# EAGLE schematic untitled (EAGLE 9.0.0)
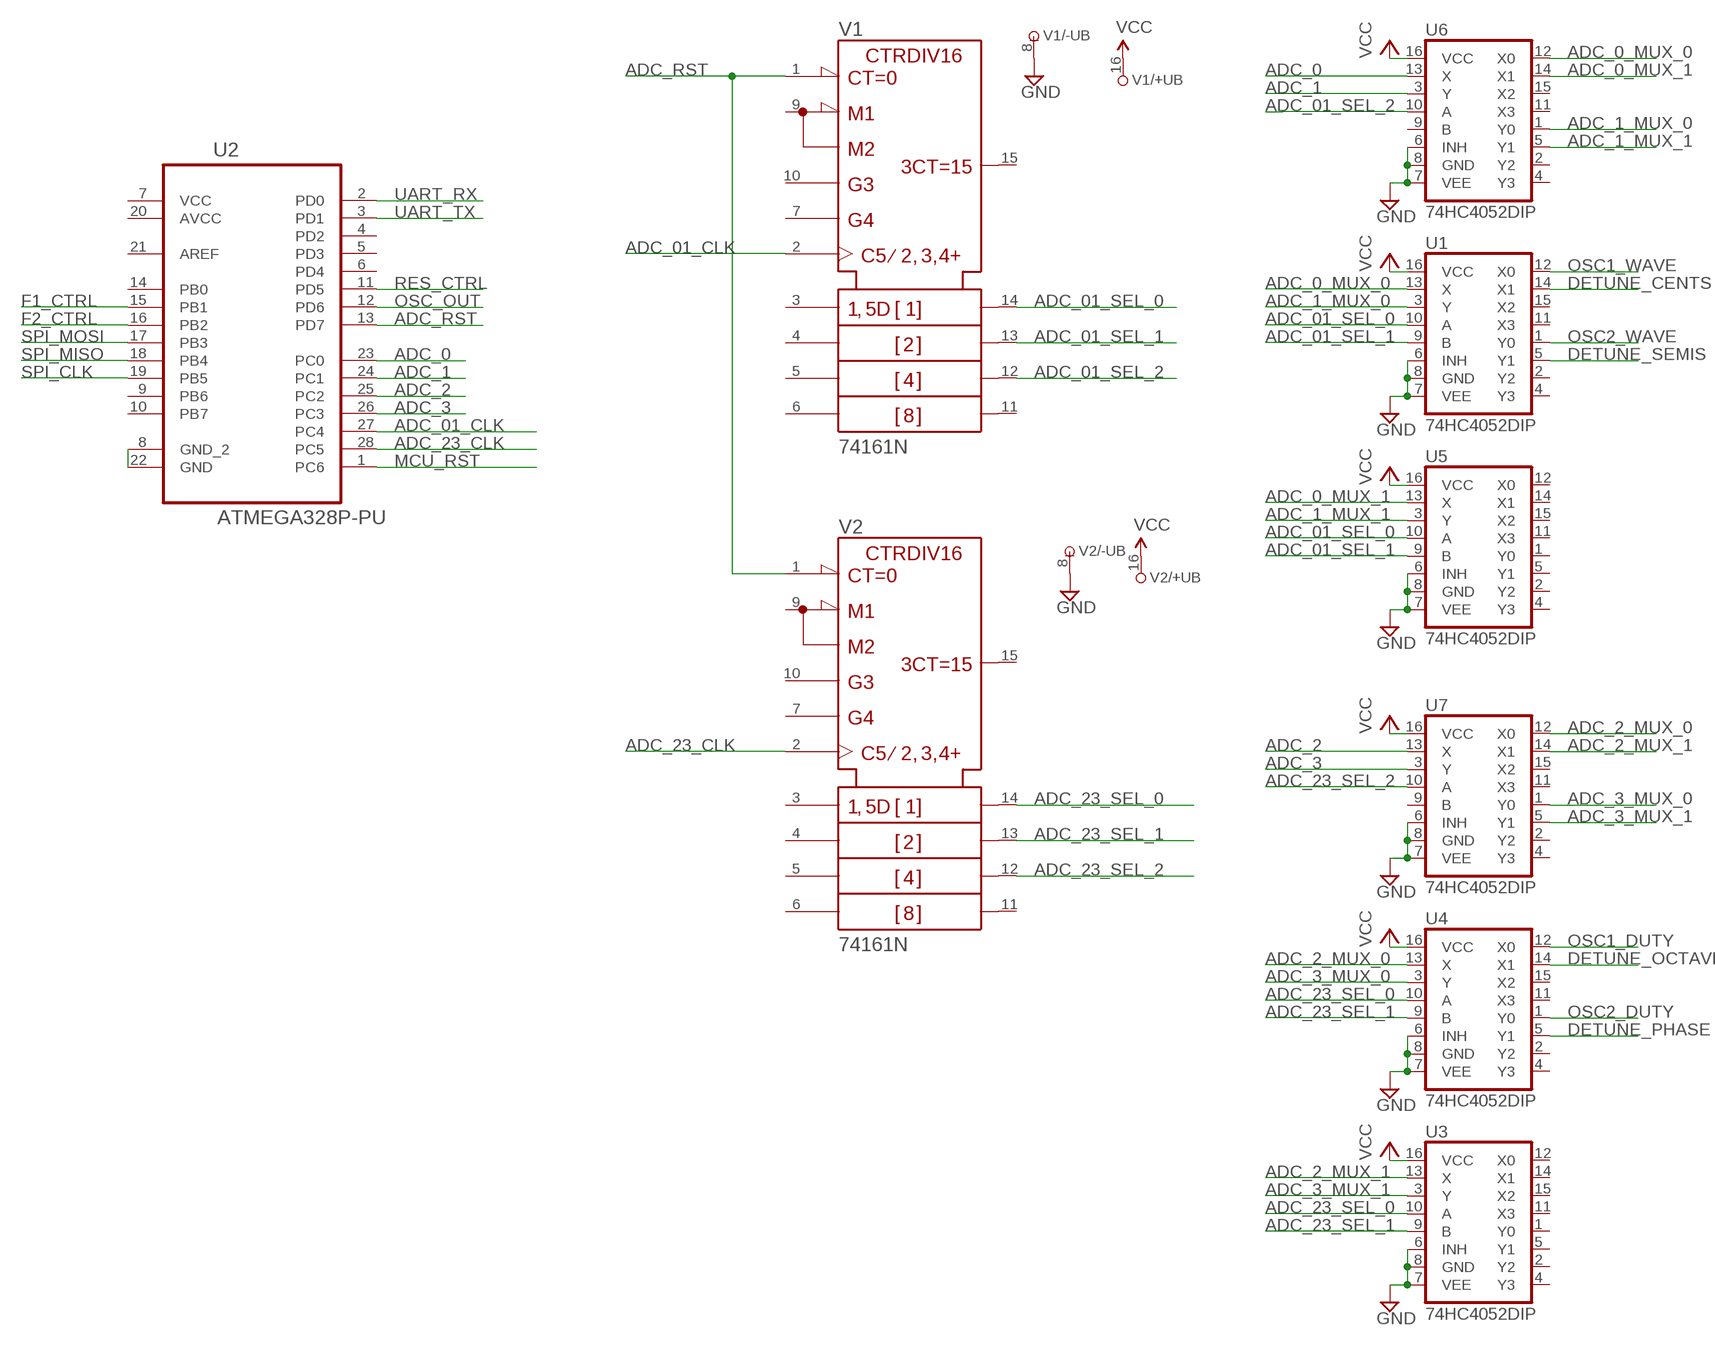
[diagram p0: schematic, sheet 1]

## Parts
U1  74HC4052DIP  [DIL16]
U2  ATMEGA328P-PU  [DIP254P762X457-28]
U3  74HC4052DIP  [DIL16]
U4  74HC4052DIP  [DIL16]
U5  74HC4052DIP  [DIL16]
U6  74HC4052DIP  [DIL16]
U7  74HC4052DIP  [DIL16]
V1  74161N  [DIL16]
V2  74161N  [DIL16]

## Nets
ADC_0: U2.23(PC0) U6.13(X)
ADC_0_MUX_0: U1.13(X) U6.12(X0)
ADC_0_MUX_1: U5.13(X) U6.14(X1)
ADC_1: U2.24(PC1) U6.3(Y)
ADC_01_CLK: U2.27(PC4) V1.2(CLK)
ADC_1_MUX_0: U1.3(Y) U6.1(Y0)
ADC_1_MUX_1: U5.3(Y) U6.5(Y1)
ADC_01_SEL_0: U1.10(A) U5.10(A) V1.14(QA)
ADC_01_SEL_1: U1.9(B) U5.9(B) V1.13(QB)
ADC_01_SEL_2: U6.10(A) V1.12(QC)
ADC_2: U2.25(PC2) U7.13(X)
ADC_2_MUX_0: U4.13(X) U7.12(X0)
ADC_2_MUX_1: U3.13(X) U7.14(X1)
ADC_3: U2.26(PC3) U7.3(Y)
ADC_3_MUX_0: U4.3(Y) U7.1(Y0)
ADC_3_MUX_1: U3.3(Y) U7.5(Y1)
ADC_23_CLK: U2.28(PC5) V2.2(CLK)
ADC_23_SEL_0: U3.10(A) U4.10(A) V2.14(QA)
ADC_23_SEL_1: U3.9(B) U4.9(B) V2.13(QB)
ADC_23_SEL_2: U7.10(A) V2.12(QC)
ADC_RST: U2.13(PD7) V1.1(!CLR) V2.1(!CLR)
DETUNE_CENTS: U1.14(X1)
DETUNE_OCTAVE: U4.14(X1)
DETUNE_PHASE: U4.5(Y1)
DETUNE_SEMIS: U1.5(Y1)
F1_CTRL: U2.15(PB1)
F2_CTRL: U2.16(PB2)
GND: U1.6(INH) U1.7(VEE) U1.8(GND) U3.6(INH) U3.7(VEE) U3.8(GND) U4.6(INH) U4.7(VEE) U4.8(GND) U5.6(INH) U5.7(VEE) U5.8(GND) U6.6(INH) U6.7(VEE) U6.8(GND) U7.6(INH) U7.7(VEE) U7.8(GND) V1.8(-UB) V2.8(-UB)
MCU_RST: U2.1(PC6)
N$2: U2.8(GND_2) U2.22(GND)
OSC1_DUTY: U4.12(X0)
OSC1_WAVE: U1.12(X0)
OSC2_DUTY: U4.1(Y0)
OSC2_WAVE: U1.1(Y0)
OSC_OUT: U2.12(PD6)
RES_CTRL: U2.11(PD5)
SPI_CLK: U2.19(PB5)
SPI_MISO: U2.18(PB4)
SPI_MOSI: U2.17(PB3)
UART_RX: U2.2(PD0)
UART_TX: U2.3(PD1)
VCC: U1.16(VCC) U3.16(VCC) U4.16(VCC) U5.16(VCC) U6.16(VCC) U7.16(VCC) V1.16(+UB) V2.16(+UB)
Unconnected: U1.2(Y2) U1.4(Y3) U1.11(X3) U1.15(X2) U2.4(PD2) U2.5(PD3) U2.6(PD4) U2.9(PB6) U2.10(PB7) U2.14(PB0) U2.21(AREF) U3.1(Y0) U3.2(Y2) U3.4(Y3) U3.5(Y1) U3.11(X3) U3.12(X0) U3.14(X1) U3.15(X2) U4.2(Y2) U4.4(Y3) U4.11(X3) U4.15(X2) U5.1(Y0) U5.2(Y2) U5.4(Y3) U5.5(Y1) U5.11(X3) U5.12(X0) U5.14(X1) U5.15(X2) U6.2(Y2) U6.4(Y3) U6.9(B) U6.11(X3) U6.15(X2) U7.2(Y2) U7.4(Y3) U7.9(B) U7.11(X3) U7.15(X2) V1.3(A) V1.4(B) V1.5(C) V1.6(D) V1.7(ENP) V1.9(!LOAD) V1.10(ENT) V1.11(QD) V1.15(RCO) V2.3(A) V2.4(B) V2.5(C) V2.6(D) V2.7(ENP) V2.9(!LOAD) V2.10(ENT) V2.11(QD) V2.15(RCO)

## Power pins joined to a net without a drawn wire
AVCC: U2.20(AVCC)
VCC: U2.7(VCC)

## Library data of the parts
U1 U3-U7 = SparkFun-AnalogIC:74HC4052: Dual 4:1 analog mux
U2 = Atmel_By_element14_Batch_1-00:ATMEGA328P-PU: 8-bit Microcontroller with In-System Programmable Flash; MPN: ATMEGA328P-PU; OC_FARNELL: 1715487; OC_NEWARK: 15R0268; PACKAGE: PDIP-28; SUPPLIER: Atmel
V1 V2 = 74ttl-din:74*161: Synchrounus 4-bit COUNTER